# EAGLE design deepblue (EAGLE 8.2.0)
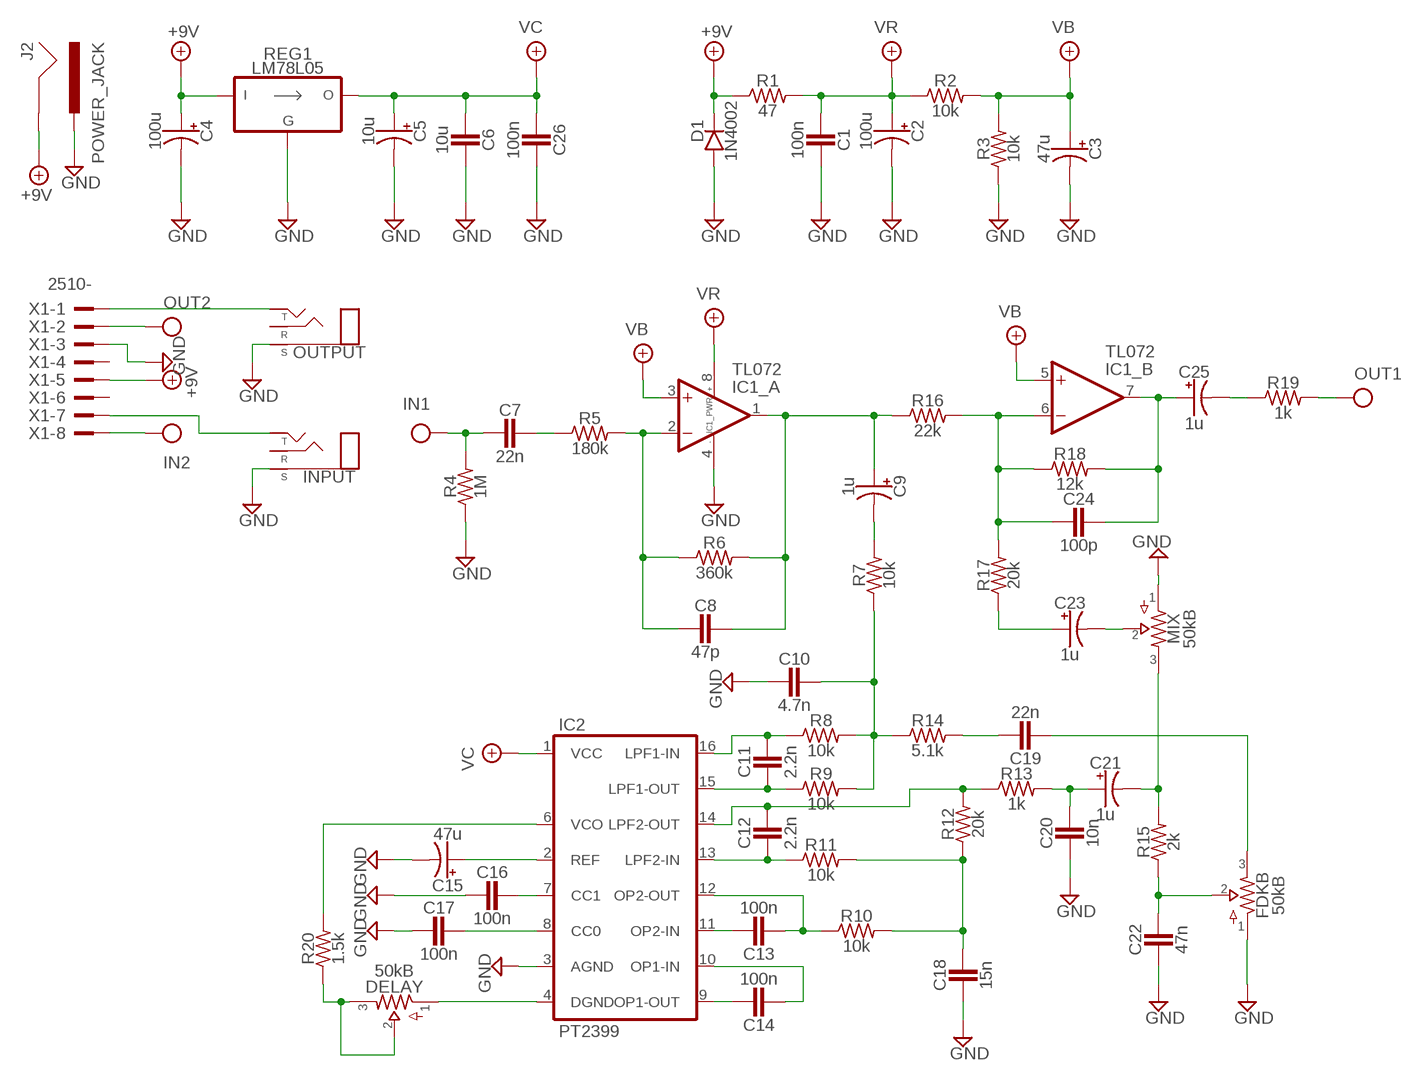
[diagram p0: schematic, sheet 1]

## Parts
C1  100n  CER/FILM2  [050X030_025_2]
C2  100u  0500  [050_020]
C3  47u  0500  [050_020]
C4  100u  0500  [050_020]
C5  10u  0500  [050_020]
C6  10u  CER/FILM1  [050X030_025]
C7  22n  CER/FILMBOX.1  [BOX_SMALL]
C8  47p  CER/FILM2  [050X030_025_2]
C9  1u  0400  [040_020]
C10  4.7n  CER/FILMBOX.1  [BOX_SMALL]
C11  2.2n  CER/FILMBOX.1  [BOX_SMALL]
C12  2.2n  CER/FILMBOX.1  [BOX_SMALL]
C13  100n  CER/FILMBOX.1  [BOX_SMALL]
C14  100n  CER/FILMBOX.1  [BOX_SMALL]
C15  47u  0500  [050_020]
C16  100n  CER/FILMBOX.1  [BOX_SMALL]
C17  100n  CER/FILMBOX.1  [BOX_SMALL]
C18  15n  CER/FILMBOX.1  [BOX_SMALL]
C19  22n  CER/FILMBOX.1  [BOX_SMALL]
C20  10n  CER/FILMBOX.1  [BOX_SMALL]
C21  1u  0400  [040_020]
C22  47n  CER/FILMBOX.1  [BOX_SMALL]
C23  1u  0400  [040_020]
C24  100p  CER/FILM2  [050X030_025_2]
C25  1u  0400  [040_020]
C26  100n  CER/FILM2  [050X030_025_2]
D1  1N4002  DO41.2  [DO41-2]
DELAY  50kB  POTS16MM  [16MM]
FDKB  50kB  POTS16MM  [16MM]
IC1  TL072  DUALTH  [DIL0]
IC2  PT2399  PT2399TH  [DIL16]
INPUT  STEREONMJ  [NMJ6HCD2]
J2  POWER_JACK  [POWER_JACK_PTH]
MIX  50kB  POTS16MM  [16MM]
OUTPUT  STEREONMJ  [NMJ6HCD2]
R1  47  R_.3B  [R0207/3]
R2  10k  R_.3B  [R0207/3]
R3  10k  R_.3B  [R0207/3]
R4  1M  R_.3B  [R0207/3]
R5  180k  R_.3B  [R0207/3]
R6  360k  R_.3B  [R0207/3]
R7  10k  R_.3B  [R0207/3]
R8  10k  R_.3B  [R0207/3]
R9  10k  R_.3B  [R0207/3]
R10  10k  R_.3B  [R0207/3]
R11  10k  R_.3B  [R0207/3]
R12  20k  R_.3B  [R0207/3]
R13  1k  R_.3B  [R0207/3]
R14  5.1k  R_.3B  [R0207/3]
R15  2k  R_.3B  [R0207/3]
R16  22k  R_.3B  [R0207/3]
R17  20k  R_.3B  [R0207/3]
R18  12k  R_.3B  [R0207/3]
R19  1k  R_.3B  [R0207/3]
R20  1.5k  R_.3B  [R0207/3]
REG1  LM78L05  [TO92-]
X1  2510-  [PAK100/2500-10]

## Nets
+18V: C4.+ D1.C J2.GND R1.1 REG1.1(VI) X1.5 ; supply symbol labelled +9V
GND: C1.1 C2.- C3.- C4.- C5.- C6.1 C10.2 C15.- C16.2 C17.2 C18.2 C20.2 C22.2 C26.1 D1.A FDKB.1 IC1.4(_PWR:V-) IC2.3(AGND) INPUT.S J2.PWR MIX.1 OUTPUT.S R3.1 R4.1 REG1.2(GND) X1.3
IN: C7.2 R4.2 X1.8
N$1: C7.1 R5.1
N$2: C8.2 IC1.2(_A:-IN) R5.2 R6.1
N$3: C8.1 C9.+ IC1.1(_A:OUT) R6.2 R16.1
N$4: C15.+ IC2.2(REF)
N$5: C16.1 IC2.7(CC1)
N$6: C17.1 IC2.8(CC0)
N$7: C11.2 IC2.15(LPF1-OUT) R9.1
N$8: C11.1 IC2.16(LPF1-IN) R8.1
N$9: C13.2 IC2.12(OP2-OUT) R10.1
N$10: C13.1 IC2.11(OP2-IN)
N$11: C14.2 IC2.10(OP1-IN)
N$12: C14.1 IC2.9(OP1-OUT)
N$13: C9.- R7.2
N$14: C10.1 R7.1 R8.2 R9.2 R14.1
N$15: C12.2 IC2.13(LPF2-IN) R11.1
N$16: C12.1 IC2.14(LPF2-OUT) R12.2 R13.1
N$17: C18.1 R10.2 R11.2 R12.1
N$18: C19.1 R14.2
N$19: C20.1 C21.+ R13.2
N$20: C21.- MIX.3 R15.2
N$21: C22.1 FDKB.2 R15.1
N$22: C19.2 FDKB.3
N$23: C23.+ R17.1
N$24: C23.- MIX.2
N$25: C24.2 IC1.6(_B:-IN) R16.2 R17.2 R18.1
N$26: C24.1 C25.+ IC1.7(_B:OUT) R18.2
N$27: C25.- R19.1
N$28: DELAY.1 IC2.4(DGND)
N$29: DELAY.2 DELAY.3 R20.1
N$30: IC2.6(VCO) R20.2
N$35: OUTPUT.T X1.1
N$36: INPUT.T X1.7
OUT: R19.2 X1.2
VB: C3.+ IC1.3(_A:+IN) IC1.5(_B:+IN) R2.2 R3.2
VC: C5.+ C6.2 C26.2 IC2.1(VCC) REG1.3(VO)
VR: C1.2 C2.+ IC1.8(_PWR:V+) R1.2 R2.1
Unconnected: INPUT.R OUTPUT.R X1.4 X1.6

## Library data of the parts
C1 C6-C8 C10-C14 C16-C20 C22 C24 C26 = pedals-capacitors-film:CER/FILM: 47 - 120pF Xicon Ceramic Disc 2.5mm lead spacing
C2-C5 C15 = pedals-capacitors-elec:050
C9 C21 C23 C25 = pedals-capacitors-elec:040
D1 = pedals-diodes:DO41: DO-41 Package Diodes: 1N4001 - 1N40019 Zener Diodes: 1N4728 - 1N4764
DELAY FDKB MIX = pedals-potentiometers:POTS
IC1 = pedals-integrated circuits:DUAL: OP AMP
IC2 = pedals-integrated circuits:PT2399: Echo Processor IC
INPUT OUTPUT = pedals-jacks:STEREO
J2 = pedals-jacks:POWER_JACK: Power Jack Connector This is the standard 5.5mm barrel jack for power. The PTH is the most common, proven, reliable, footprint. The Slot footprint only works if the mill layer is transmitted to the PCB fab house so be warned. Here are the connectors we sell at SparkFun: DC Barrel Power Jack/Connector <https://www.sparkfun.com/products/119> (PRT-00119) DC Barrel Power Jack/Connector (SMD) <https://www.sparkfun.com/products/12748> (PRT-12748) DC Barrel Jack Adapter - Breadboard Compatible <https://www.sparkfun.com/products/10811> (PRT-10811) It is used on this SparkFun product (and many, many others): SparkFun RedBoard - Programmed with Arduino <https://www.sparkfun.com/products/12757> (DEV-12757) Also, if you need a mating power supply or connector, please check these out: Wall Adapter Power Supply - 9VDC 650mA <https://www.sparkfun.com/products/298> (TOL-00298) DC Barrel Jack Adapter - Male <https://www.sparkfun.com/products/10287> (PRT-10287); PROD_ID: CONN-08197
R1-R20 = pedals-resistors:R_
REG1 = pedals-regulators:LM78L05
X1 = pedals-headers:2510-: 3M (TM) Pak 100 4-Wall Header Source: 3M; MF: 3M; MPN: 2510-6002UB; OC_FARNELL: 9838244; OC_NEWARK: 46F4725

## Board
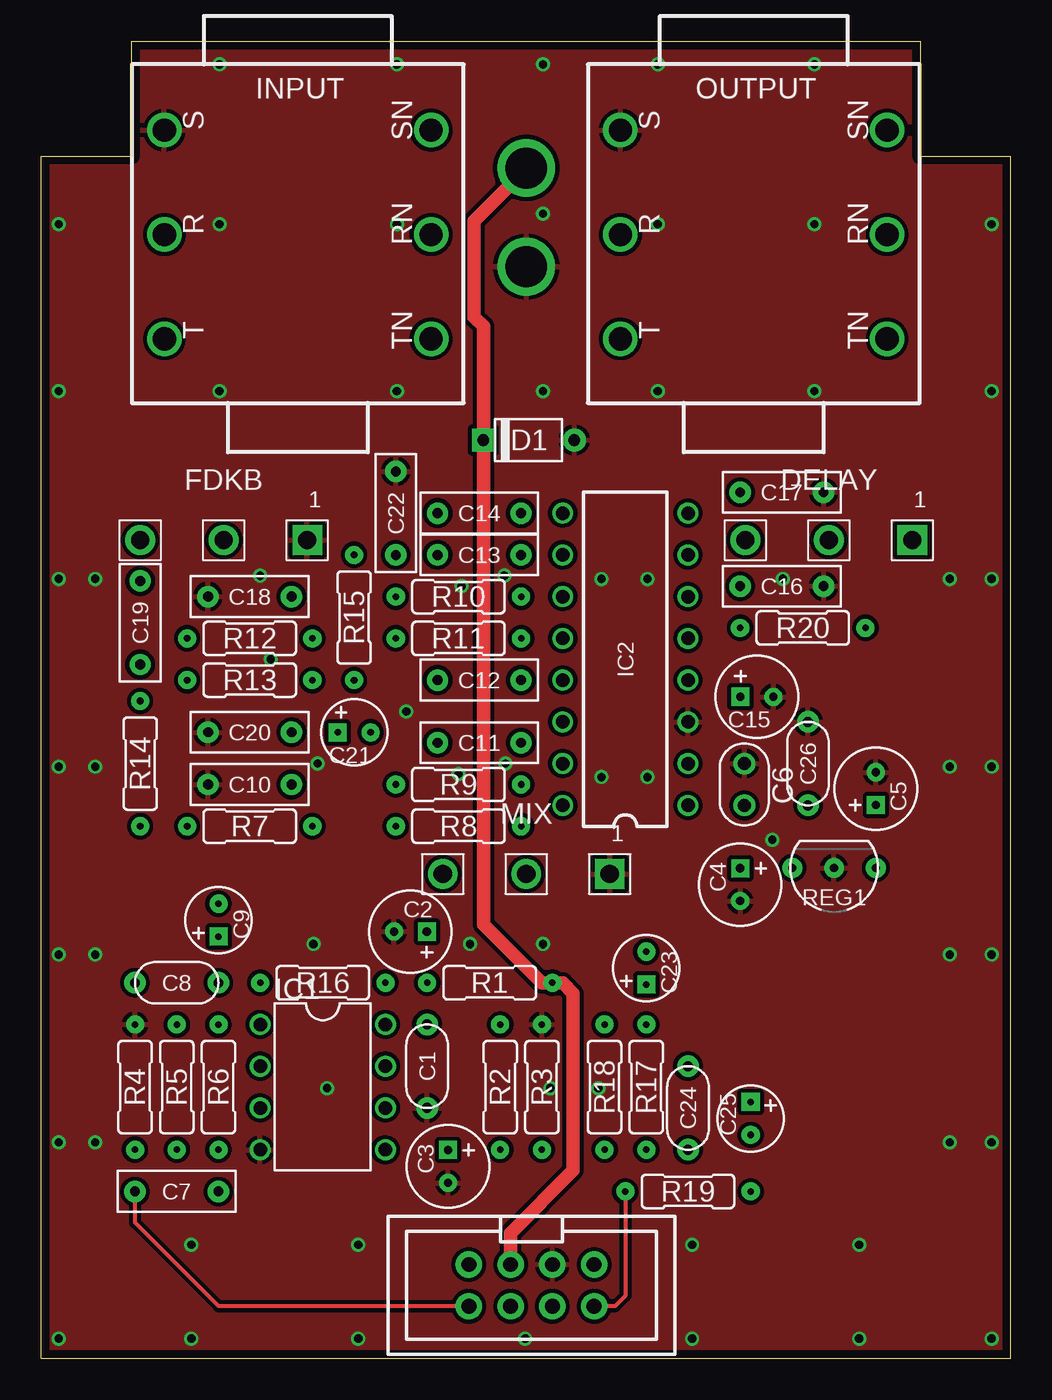
[diagram p1: board, top side]
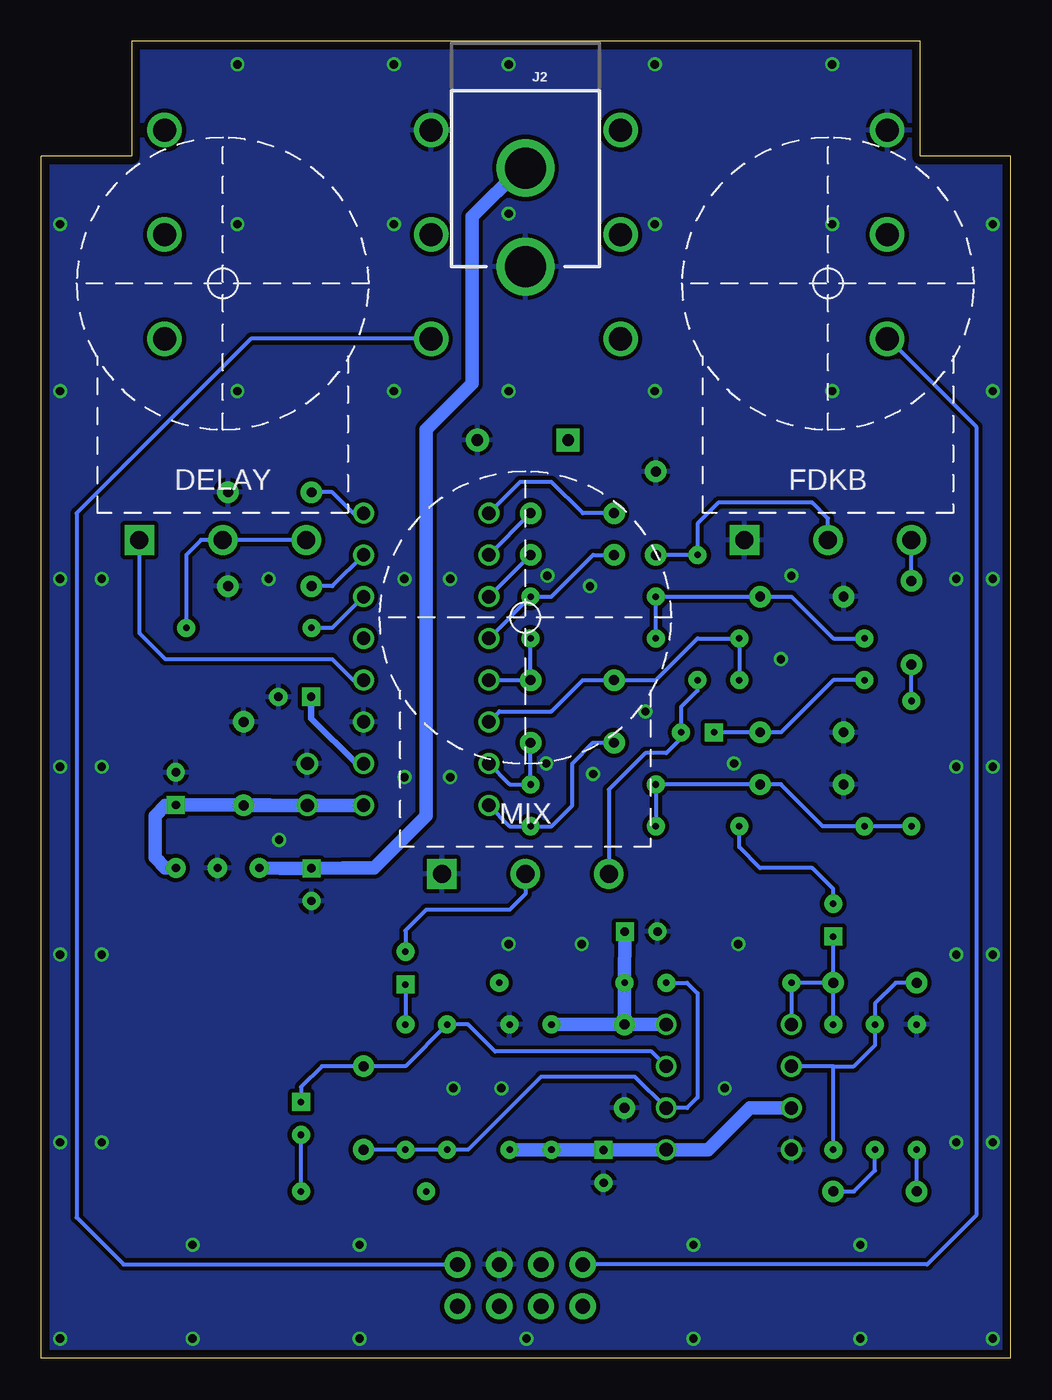
[diagram p2: board, bottom side, seen from below]

Size 59 x 80.16 mm. Coordinates in mm from the lower left corner, seen from the top.
Copper layers (1*16): Top 0.035mm / dielectric 1.6mm / Bottom 0.035mm
Design rules "Elecrow_2-layer_PCB_eagle_rule": minimum track width 6mil, minimum drill 12mil, track to track 6mil, track to pad 6mil, pad to pad 6mil, via to via 8mil, smd to smd 0mil, copper to edge 20mil, drill to drill 10mil, minimum pad ring 6mil, minimum via ring 6mil, stop-mask expansion 0mil, vias tented up to drill 100mil, thermal gap 10mil

### Footprints (pad centres in the part's own frame; a part is rotated, then mirrored left to right if it is on the bottom)
050X030_025_2 = drill 0.6 pad 1.3: 1 -2.54,0; 2 2.54,0
050_020 = drill 0.5 pad 1.1 square: + -0.998,0.001 | drill 0.5 pad 1.1: - 0.998,0.001
050X030_025 = drill 0.8 pad 1.321: 1 -1.27,0; 2 1.27,0
BOX_SMALL = drill 0.6 pad 1.3: 1 -2.54,0; 2 2.54,0
040_020 = drill 0.4 pad 1.1 square: + -1.001,0 | drill 0.4 pad 1.1: - 1.001,0
DO41-2 = drill 0.7 pad 1.4: A 2.794,0 | drill 0.7 pad 1.4 square: C -2.731,0
16MM = drill 1.1 pad 1.8 square: 1 5.08,-1 | drill 1.1 pad 1.8: 2 0,-1; 3 -5.08,-1
DIL0 = drill 0.813 pad 1.27: 1 -3.81,-3.81; 2 -1.27,-3.81; 3 1.27,-3.81; 4 3.81,-3.81; 5 3.81,3.81; 6 1.27,3.81; 7 -1.27,3.81; 8 -3.81,3.81
DIL16 = drill 0.813 pad 1.27: 1 -8.89,-3.81; 2 -6.35,-3.81; 3 -3.81,-3.81; 4 -1.27,-3.81; 5 1.27,-3.81; 6 3.81,-3.81; 7 6.35,-3.81; 8 8.89,-3.81; 9 8.89,3.81; 10 6.35,3.81; 11 3.81,3.81; 12 1.27,3.81; 13 -1.27,3.81; 14 -3.81,3.81; 15 -6.35,3.81; 16 -8.89,3.81
NMJ6HCD2 = drill 1.4: R 0,8.115; RN 0,-8.115; S 6.35,8.115; SN 6.35,-8.115; T -6.35,8.115; TN -6.35,-8.115
POWER_JACK_PTH = drill 2.5: GND 0,7.7; PWR 0,13.7
R0207/3 = drill 0.4 pad 1.1: 1 -3.81,0; 2 3.81,0
TO92- = drill 0.5 pad 1.194: 1 -2.54,0; 2 0,0; 3 2.54,0
PAK100/2500-10 = drill 0.9 pad 1.6: 1 -3.81,-1.27; 2 -3.81,1.27; 3 -1.27,-1.27; 4 -1.27,1.27; 5 1.27,-1.27; 6 1.27,1.27; 7 3.81,-1.27; 8 3.81,1.27

### Placement (x,y rotation side)
C1  23.49,17.78 90 top
C2  22.48,25.97 180 top
C3  24.76,11.68 270 top
C4  42.54,28.83 270 top
C5  50.8,34.67 90 top
C6  42.8,34.92 270 top
C7  8.25,10.16 180 top
C8  8.25,22.86 180 top
C9  10.79,26.67 90 top
C10  12.7,34.92 180 top
C11  26.67,37.47 0 top
C12  26.67,41.27 0 top
C13  26.67,48.9 180 top
C14  26.67,51.44 0 top
C15  43.56,40.26 0 top
C16  45.08,46.99 0 top
C17  45.08,52.7 0 top
C18  12.7,46.36 180 top
C19  6.03,44.77 90 top
C20  12.7,38.1 180 top
C21  19.05,38.1 0 top
C22  21.59,51.44 90 top
C23  36.83,23.75 90 top
C24  39.37,15.24 270 top
C25  43.18,14.61 270 top
C26  46.67,36.2 270 top
D1  29.65,55.88 0 top
DELAY  47.94,50.8 0 top
FDKB  11.11,50.8 0 top
IC1  17.14,16.51 270 top
IC2  35.56,42.55 90 top
INPUT  15.62,68.39 90 top
J2  29.53,80.14 180 bottom
MIX  29.53,30.48 0 top
OUTPUT  43.37,68.39 90 top
R1  27.3,22.86 180 top
R2  27.94,16.51 270 top
R3  30.48,16.51 270 top
R4  5.71,16.51 270 top
R5  8.25,16.51 90 top
R6  10.79,16.51 90 top
R7  12.7,32.39 0 top
R8  25.4,32.39 180 top
R9  25.4,34.92 180 top
R10  25.4,46.36 180 top
R11  25.4,43.81 180 top
R12  12.7,43.81 0 top
R13  12.7,41.27 180 top
R14  6.03,36.2 90 top
R15  19.05,45.09 270 top
R16  17.14,22.86 0 top
R17  36.83,16.51 270 top
R18  34.29,16.51 90 top
R19  39.37,10.16 180 top
R20  46.35,44.45 180 top
REG1  48.26,29.84 0 top
U$2  [125B_PCB_HUGE]  0,-7.62 0 top  (outside the outline)
X1  29.84,4.45 180 top

### Tracks (layer width: path | path; a pad name or v marks a point on that pad's centre or on a via)
+18V
  Top 0.813: J2.GND 29.53,72.39 26.35,69.22 26.35,63.37 26.92,62.8 D1.C 26.92,26.42 30.48,22.86 R1.1 31.75,22.86 32.38,22.23 32.38,11.43 28.57,7.62 X1.5
  Bottom 0.813: REG1.1 44.43,29.83 C4.+ 40.62,29.84 38.73,29.84 35.56,33.02 35.56,56.52 32.77,59.31 32.77,69.47 29.8,72.44 J2.GND
GND  (via drill 0.5 pad 0.85)
  other vias: 57.85,69.02 57.85,58.86 10.86,78.74 21.65,78.74 30.54,78.74 1.08,58.86 10.86,69.02 10.86,58.86 21.65,58.86 30.54,69.66 30.54,58.86 37.53,78.74 47.05,78.74 37.53,69.02 37.53,58.86 47.05,69.02 47.05,58.86 57.85,47.43 57.85,36 57.85,24.57 57.85,13.14 57.85,1.21 49.78,1.21 39.62,1.21 29.46,1.21 19.3,1.21 9.14,1.21 1.08,1.21 1.08,69.02 1.08,47.43 1.08,36 1.08,24.57 1.08,13.14 21.65,69.02 19.3,6.92 9.14,6.92 39.62,6.92 49.78,6.92 55.31,13.14 55.31,24.57 55.31,36 55.31,47.43 33.91,16.45 30.99,16.45 30.54,25.21 26.1,25.21 17.4,16.45 3.3,13.14 3.3,24.57 3.3,36 3.3,47.43 28.26,36.2 25.4,35.56 28.19,47.62 25.59,46.99 13.97,42.55 22.22,39.37 45.15,47.43 36.89,47.43 34.1,47.43 36.89,35.37 34.1,35.37 44.51,31.56 16.57,25.21 16.83,36.2 13.33,47.62
  pour Top (isolate 0.254): 0,73.03 0,0 59.06,0 59.06,73.66 53.34,73.03 53.34,80.01 5.71,80.01 5.71,73.03
  pour Bottom (isolate 0.254): 0,0 59.06,0 59.06,73.03 53.97,73.03 53.97,80.64 5.08,80.64 5.08,73.03 0,73.03
IN
  Top 0.254: X1.8 10.79,3.18 5.71,8.26 C7.2
  Bottom 0.254: C7.2 R4.2
N$1
  Bottom 0.254: C7.1 9.52,10.16 8.25,11.43 R5.1
N$2
  Bottom 0.254: 10.79,17.78 IC1.2 | 10.79,17.78 9.52,17.78 8.25,19.05 R5.2 8.25,21.59 6.98,22.86 C8.2 | R6.1 10.79,17.78
N$3
  Bottom 0.254: IC1.1 R16.1 C8.1 | R6.2 C8.1 | C8.1 C9.+
N$4
  Bottom 0.406: C15.+ 42.56,38.94 39.81,36.2 IC2.2
N$5
  Bottom 0.254: IC2.7 41.27,46.99 C16.1
N$6
  Bottom 0.254: IC2.8 40,51.44 41.27,52.7 C17.1
N$7
  Bottom 0.254: IC2.15 30.48,34.92 R9.1 C11.2
N$8
  Bottom 0.254: IC2.16 30.48,32.39 R8.1 27.94,32.39 26.67,33.66 26.67,36.2 25.4,37.47 C11.1
N$9
  Bottom 0.254: IC2.12 R10.1 27.94,46.36 25.4,48.9 C13.2
N$10
  Bottom 0.254: IC2.11 C13.1
N$11
  Bottom 0.254: IC2.10 C14.2
N$12
  Bottom 0.254: C14.1 26.03,51.44 27.94,53.34 29.84,53.34 IC2.9
N$13
  Bottom 0.254: C9.- 10.79,28.57 12.06,29.84 15.24,29.84 16.51,31.12 R7.2
N$14
  Bottom 0.254: R8.2 R9.2 C10.1 13.97,34.92 11.43,32.39 R7.1 R14.1
N$15
  Bottom 0.254: IC2.13 C12.2 R11.1
N$16
  Bottom 0.254: IC2.14 31.11,39.37 27.94,39.37 26.03,41.27 C12.1 21.59,41.27 19.05,43.81 R12.2 R13.1
N$17
  Bottom 0.254: R11.2 R10.2 C18.1 13.33,46.36 10.79,43.81 R12.1
N$18
  Bottom 0.254: R14.2 C19.1
N$19
  Bottom 0.254: R13.2 10.79,41.27 13.97,38.1 C20.1 C21.+
N$20
  Bottom 0.254: R15.2 19.05,40.64 20.05,39.64 C21.- 20.05,37.73 20.95,36.83 22.22,36.83 24.45,34.61 MIX.3
N$21
  Bottom 0.254: C22.1 R15.1 19.05,50.8 17.78,52.07 12.06,52.07 11.11,51.12 FDKB.2
N$22
  Bottom 0.254: C19.2 FDKB.3
N$23
  Bottom 0.254: C23.+ 36.81,20.34 R17.1
N$24
  Bottom 0.254: MIX.2 29.53,28.26 30.48,27.3 35.56,27.3 36.83,26.04 C23.-
N$25
  Bottom 0.254: R16.2 19.68,22.86 19.05,22.23 19.05,15.88 19.68,15.24 IC1.6 22.86,17.15 28.57,17.15 33.02,12.7 R18.1 R17.2 C24.2
N$26
  Bottom 0.254: C24.1 36.83,17.78 R18.2 33.02,20.32 31.37,18.67 21.84,18.67 IC1.7 | 40,17.78 C24.1 | C24.1 41.91,17.78 43.18,16.51 C25.+
N$27
  Bottom 0.254: R19.1 C25.-
N$28
  Bottom 0.254: IC2.4 40,41.27 41.27,42.55 51.43,42.55 53.02,44.13 DELAY.1
N$29
  Bottom 0.254: R20.1 50.16,48.9 49.26,49.8 DELAY.2 DELAY.3
N$30
  Bottom 0.254: IC2.6 41.27,44.45 R20.2
N$35
  Bottom 0.254: X1.1 53.97,5.72 56.83,8.57 56.83,51.44 46.23,62.04 OUTPUT.T
N$36
  Bottom 0.254: X1.7 5.08,5.72 2.09,8.7 2.09,56.71 7.43,62.04 INPUT.T 7.37,62.04
OUT
  Top 0.254: R19.2 35.56,3.81 34.92,3.18 X1.2
VB
  Bottom 0.813: R3.2 R2.2 27.92,12.68 C3.+ 24.75,12.7 IC1.5 18.41,12.7 15.88,15.24 IC1.3
VC
  Bottom 0.813: IC2.1 C6.2 C26.2 45.1,33.67 C5.+ 50.82,33.66 51.43,33.66 52.07,33.02 52.07,30.48 51.43,29.84 REG1.3
VR
  Bottom 0.813: C2.+ R1.2 C1.2 | C1.2 IC1.8 | C1.2 R2.1